# EAGLE schematic digitizer2 (EAGLE 8.0.1)

## Sheet 1 of 2
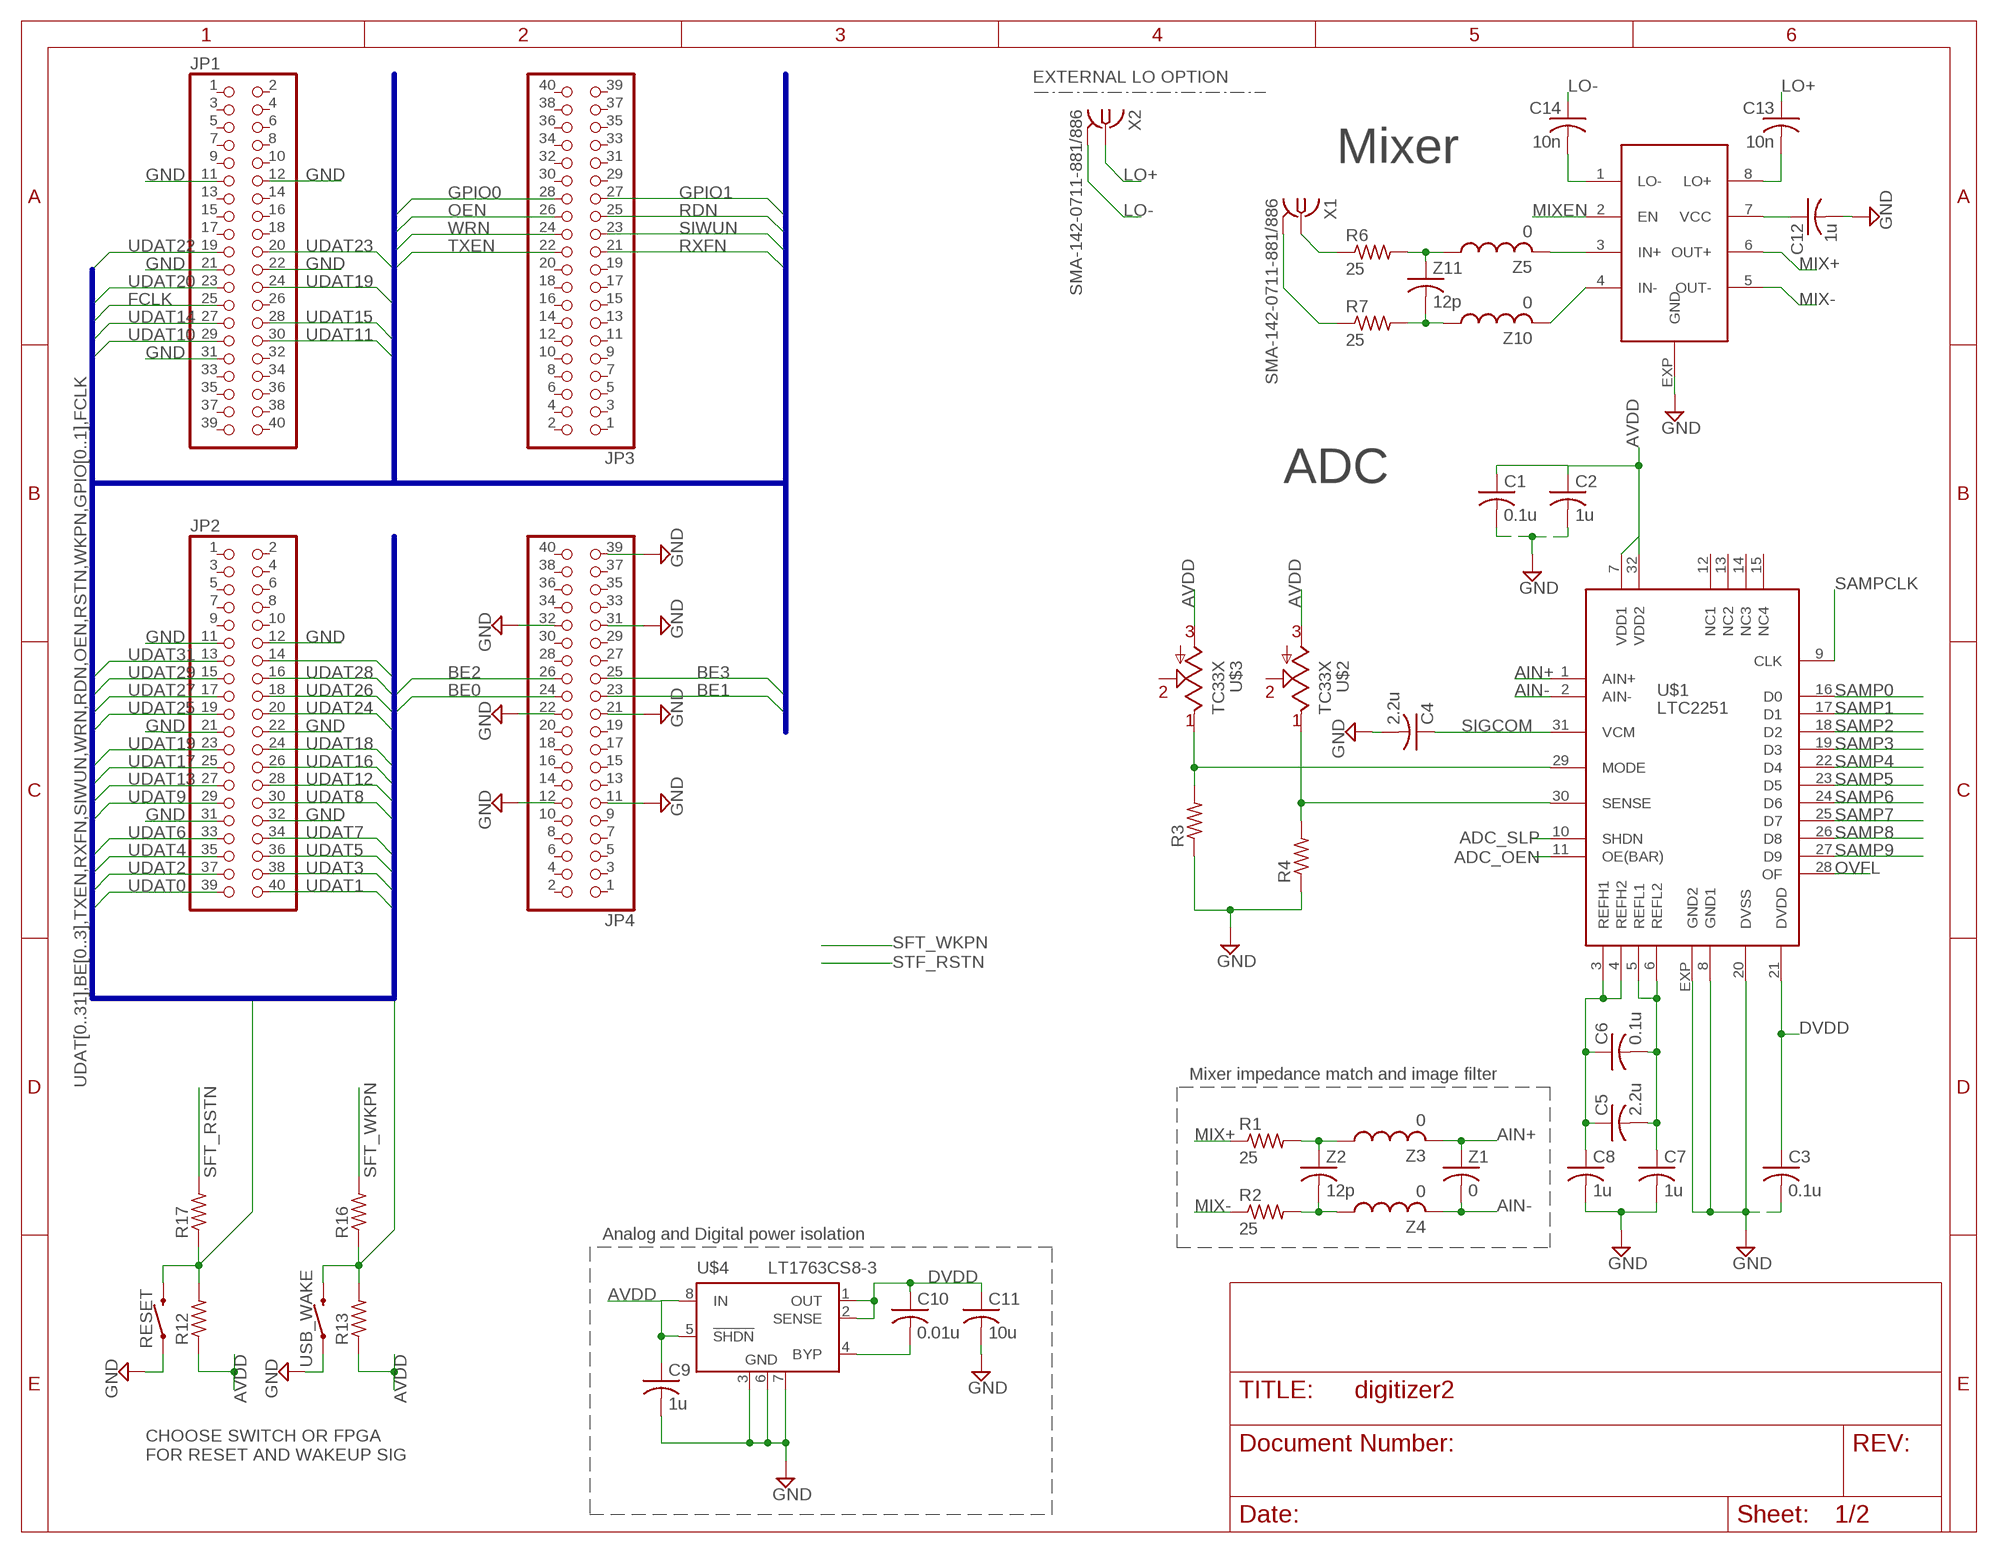
[diagram p0: schematic, sheet 1]

### Parts
C1  0.1u  C-USC0402  [C0402]
C2  1u  C-USC0402  [C0402]
C3  0.1u  C-USC0402  [C0402]
C4  2.2u  C-USC0402  [C0402]
C5  2.2u  C-USC0402  [C0402]
C6  0.1u  C-USC0402  [C0402]
C7  1u  C-USC0402  [C0402]
C8  1u  C-USC0402  [C0402]
C9  1u  C-USC0402  [C0402]
C10  0.01u  C-USC0402  [C0402]
C11  10u  C-USC0402  [C0402]
C12  1u  C-USC0402  [C0402]
C13  10n  C-USC0402  [C0402]
C14  10n  C-USC0402  [C0402]
JP1  PINHD-2X20  [2X20]
JP2  PINHD-2X20  [2X20]
JP3  PINHD-2X20  [2X20]
JP4  PINHD-2X20  [2X20]
R1  25  R-US_R0402  [R0402]
R2  25  R-US_R0402  [R0402]
R3  R-US_R0402  [R0402]
R4  R-US_R0402  [R0402]
R6  25  R-US_R0402  [R0402]
R7  25  R-US_R0402  [R0402]
R12  R-US_R0402  [R0402]
R13  R-US_R0402  [R0402]
R16  R-US_R0402  [R0402]
R17  R-US_R0402  [R0402]
RESET  MOMENTARY-SWITCH-SPST-SMD-6.0X3.5MM  [TACTILE_SWITCH_SMD_6.0X3.5MM]
U$1  LTC2251  [HVQFN32]
U$2  TC33X  [SC59-POT]
U$3  TC33X  [SC59-POT]
U$4  LT1763CS8-3  [SOIC8]
U$5  LT5560  [DFN8-3X3]
USB_WAKE  MOMENTARY-SWITCH-SPST-SMD-6.0X3.5MM  [TACTILE_SWITCH_SMD_6.0X3.5MM]
X1  SMA-142-0711-881/886  [J502-ND-142-0711-881/886]
X2  SMA-142-0711-881/886  [J502-ND-142-0711-881/886]
Z1  0  C-USC0402  [C0402]
Z2  12p  C-USC0402  [C0402]
Z3  0  L-US0402  [R0402]
Z4  0  L-US0402  [R0402]
Z5  0  L-US0402  [R0402]
Z10  0  L-US0402  [R0402]
Z11  12p  C-USC0402  [C0402]

### Nets
ADC_OEN: U$1.11(OE(BAR))
ADC_SLP: U$1.10(SHDN)
AIN+: U$1.1(AIN+) Z1.1 Z3.2
AIN-: U$1.2(AIN-) Z1.2 Z4.2
AVDD: C1.1 C2.1 C9.1 R12.1 R13.1 U$1.7(VDD1) U$1.32(VDD2) U$2.3 U$3.3 U$4.5(!SHDN) U$4.8(IN)
BE0: JP4.24 ; also sheet 2
BE1: JP4.23 ; also sheet 2
BE2: JP4.26 ; also sheet 2
BE3: JP4.25 ; also sheet 2
DVDD: C3.1 C10.1 C11.1 U$1.21(DVDD) U$4.1(OUT) U$4.2(SENSE) ; also sheet 2
FCLK: JP1.25 ; also sheet 2
GND: C1.2 C2.2 C3.2 C4.2 C7.2 C8.2 C9.2 C11.2 C12.2 JP1.11 JP1.12 JP1.21 JP1.22 JP1.31 JP2.11 JP2.12 JP2.21 JP2.22 JP2.31 JP2.32 R3.1 R4.1 RESET.1 U$1.8(GND1) U$1.20(DVSS) U$1.EXP(GND2) U$4.3(GND) U$4.6(GND) U$4.7(GND) U$5.EXP(GND) USB_WAKE.1 ; also sheet 2
GND1: JP4.32
GND2: JP4.22
GND3: JP4.12
GND4: JP4.11
GND5: JP4.21
GND6: JP4.31
GPIO0: JP3.28 ; also sheet 2
GPIO1: JP3.27 ; also sheet 2
LO+: C13.1 X2.1
LO-: C14.1 X2.G@1 X2.G@2 X2.G@3 X2.G@4
MIX+: R1.1 U$5.6(OUT+)
MIX-: R2.1 U$5.5(OUT-)
MIXEN: U$5.2(EN)
N$1: R7.1 X1.G@1 X1.G@2 X1.G@3 X1.G@4
N$2: C5.1 C6.1 C8.1 U$1.3(REFH1) U$1.4(REFH2)
N$3: C5.2 C6.2 C7.1 U$1.5(REFL1) U$1.6(REFL2)
N$4: R3.2 U$1.29(MODE) U$3.1
N$5: R4.2 U$1.30(SENSE) U$2.1
N$6: R1.2 Z2.1 Z3.1
N$7: R2.2 Z2.2 Z4.1
N$9: C10.2 U$4.4(BYP)
N$10: R6.1 X1.1
N$20: C12.1 U$5.7(VCC)
N$21: C14.2 U$5.1(LO-)
N$22: C13.2 U$5.8(LO+)
N$23: R6.2 Z5.1 Z11.1
N$24: U$5.3(IN+) Z5.2
N$25: U$5.4(IN-) Z10.2
N$26: R7.2 Z10.1 Z11.2
OEN: JP3.26 ; also sheet 2
OVFL: U$1.28(OF)
RDN: JP3.25 ; also sheet 2
RSTN: R12.2 R17.1 RESET.2 ; also sheet 2
RXFN: JP3.21 ; also sheet 2
SAMP0: U$1.16(D0)
SAMP1: U$1.17(D1)
SAMP2: U$1.18(D2)
SAMP3: U$1.19(D3)
SAMP4: U$1.22(D4)
SAMP5: U$1.23(D5)
SAMP6: U$1.24(D6)
SAMP7: U$1.25(D7)
SAMP8: U$1.26(D8)
SAMP9: U$1.27(D9)
SAMPCLK: U$1.9(CLK)
SFT_RSTN: R17.2
SFT_WKPN: R16.2
SIGCOM: C4.1 U$1.31(VCM)
SIWUN: JP3.23 ; also sheet 2
TXEN: JP3.22 ; also sheet 2
UDAT0: JP2.39 ; also sheet 2
UDAT1: JP2.40 ; also sheet 2
UDAT2: JP2.37 ; also sheet 2
UDAT3: JP2.38 ; also sheet 2
UDAT4: JP2.35 ; also sheet 2
UDAT5: JP2.36 ; also sheet 2
UDAT6: JP2.33 ; also sheet 2
UDAT7: JP2.34 ; also sheet 2
UDAT8: JP2.30 ; also sheet 2
UDAT9: JP2.29 ; also sheet 2
UDAT10: JP1.29 ; also sheet 2
UDAT11: JP1.30 ; also sheet 2
UDAT12: JP2.28 ; also sheet 2
UDAT13: JP2.27 ; also sheet 2
UDAT14: JP1.27 ; also sheet 2
UDAT15: JP1.28 ; also sheet 2
UDAT16: JP2.26 ; also sheet 2
UDAT17: JP2.25 ; also sheet 2
UDAT18: JP2.24 ; also sheet 2
UDAT19: JP1.24 JP2.23 ; also sheet 2
UDAT20: JP1.23 ; also sheet 2
UDAT22: JP1.19 ; also sheet 2
UDAT23: JP1.20 ; also sheet 2
UDAT24: JP2.20 ; also sheet 2
UDAT25: JP2.19 ; also sheet 2
UDAT26: JP2.18 ; also sheet 2
UDAT27: JP2.17 ; also sheet 2
UDAT28: JP2.16 ; also sheet 2
UDAT29: JP2.15 ; also sheet 2
UDAT30: JP2.14 ; also sheet 2
UDAT31: JP2.13 ; also sheet 2
WKPN: R13.2 R16.1 USB_WAKE.2 ; also sheet 2
WRN: JP3.24 ; also sheet 2
Unconnected: JP1.1 JP1.2 JP1.3 JP1.4 JP1.5 JP1.6 JP1.7 JP1.8 JP1.9 JP1.10 JP1.13 JP1.14 JP1.15 JP1.16 JP1.17 JP1.18 JP1.26 JP1.32 JP1.33 JP1.34 JP1.35 JP1.36 JP1.37 JP1.38 JP1.39 JP1.40 JP2.1 JP2.2 JP2.3 JP2.4 JP2.5 JP2.6 JP2.7 JP2.8 JP2.9 JP2.10 JP3.1 JP3.2 JP3.3 JP3.4 JP3.5 JP3.6 JP3.7 JP3.8 JP3.9 JP3.10 JP3.11 JP3.12 JP3.13 JP3.14 JP3.15 JP3.16 JP3.17 JP3.18 JP3.19 JP3.20 JP3.29 JP3.30 JP3.31 JP3.32 JP3.33 JP3.34 JP3.35 JP3.36 JP3.37 JP3.38 JP3.39 JP3.40 JP4.1 JP4.2 JP4.3 JP4.4 JP4.5 JP4.6 JP4.7 JP4.8 JP4.9 JP4.10 JP4.13 JP4.14 JP4.15 JP4.16 JP4.17 JP4.18 JP4.19 JP4.20 JP4.27 JP4.28 JP4.29 JP4.30 JP4.33 JP4.34 JP4.35 JP4.36 JP4.37 JP4.38 JP4.39 JP4.40 U$1.12(NC1) U$1.13(NC2) U$1.14(NC3) U$1.15(NC4) U$2.2 U$3.2

### Buses
UDAT[0..31],BE[0..3],TXEN,RXFN,SIWUN,WRN,RDN,OEN,RSTN,WKPN,GPIO[0..1],FCLK

### Notes on the sheet
- EXTERNAL LO OPTION
- Mixer
- ADC
- Mixer impedance match and image filter
- Analog and Digital power isolation
- CHOOSE SWITCH OR FPGA
  FOR RESET AND WAKEUP SIG

## Sheet 2 of 2
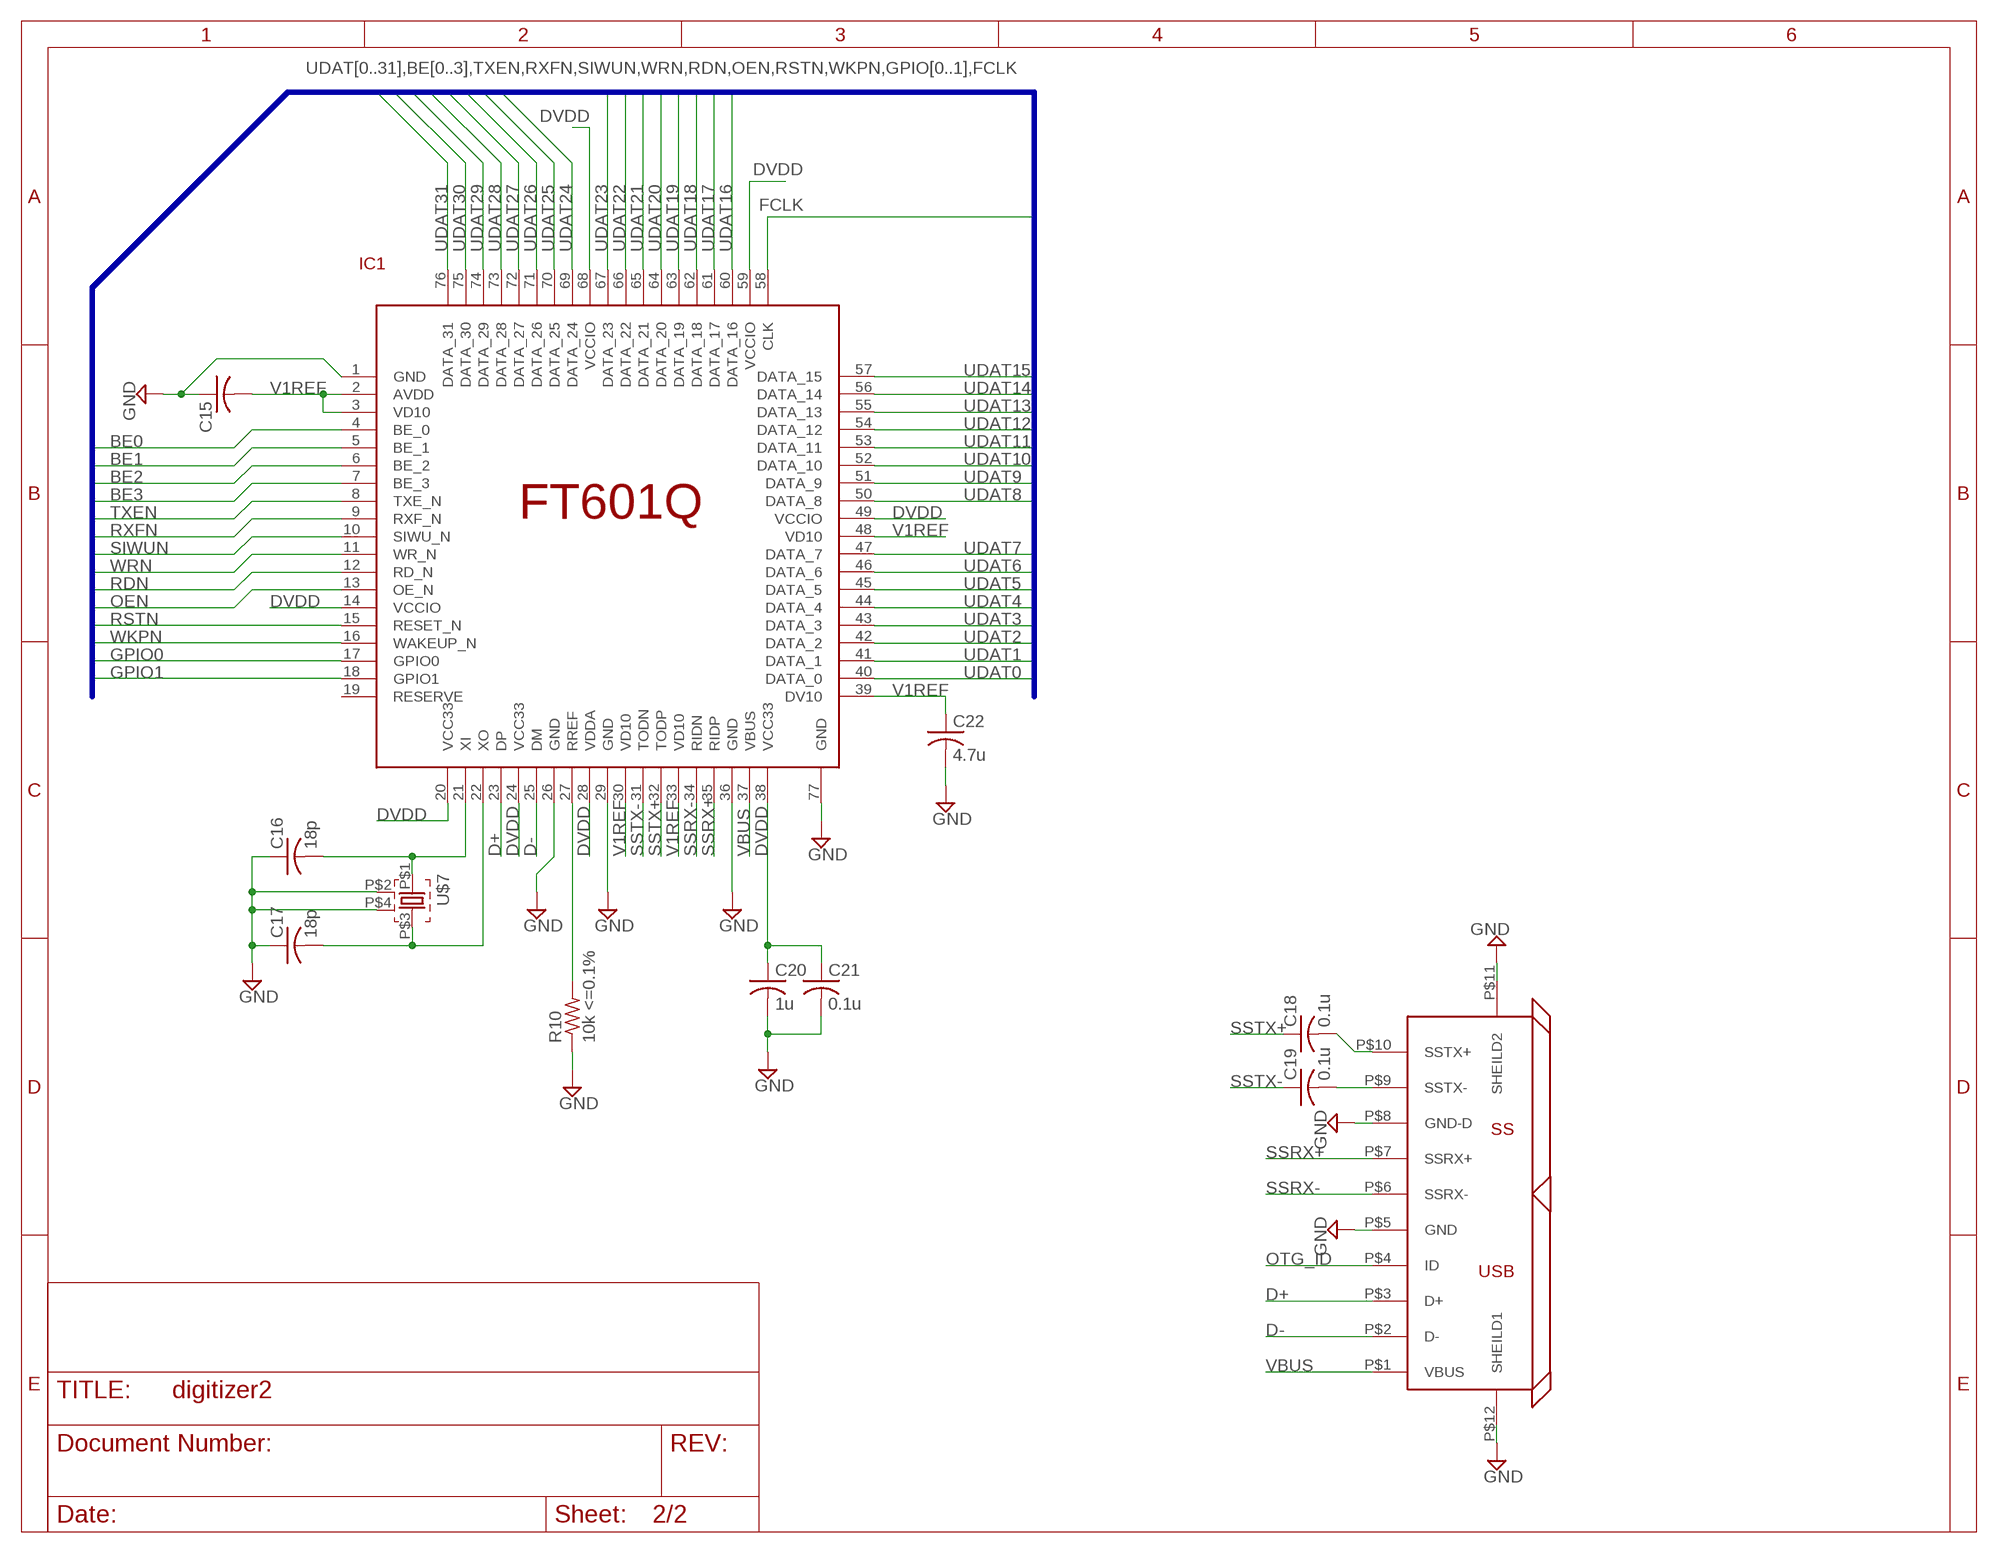
[diagram p1: schematic, sheet 2]

### Parts
C15  C-USC0402  [C0402]
C16  18p  C-USC0402  [C0402]
C17  18p  C-USC0402  [C0402]
C18  0.1u  C-USC0402  [C0402]
C19  0.1u  C-USC0402  [C0402]
C20  1u  C-USC0402  [C0402]
C21  0.1u  C-USC0402  [C0402]
C22  4.7u  C-USC0402  [C0402]
IC1  FT601QQFN76  [QFN76]
R10  10k <=0.1%  R-US_R0402  [R0402]
U$6  USB3.0  [USB-MICROB-3.0]
U$7  CX3225SB_UKY1C-H1-16357-0045  [UKY1C-H1-16357-0045]

### Nets
BE0: IC1.4(BE_0) ; also sheet 1
BE1: IC1.5(BE_1) ; also sheet 1
BE2: IC1.6(BE_2) ; also sheet 1
BE3: IC1.7(BE_3) ; also sheet 1
D+: IC1.23(DP) U$6.P$3(D+)
D-: IC1.25(DM) U$6.P$2(D-)
DVDD: C20.1 C21.1 IC1.14(VCCIO) IC1.20(VCC33) IC1.24(VCC33) IC1.28(VDDA) IC1.38(VCC33) IC1.49(VCCIO) IC1.59(VCCIO) IC1.68(VCCIO) ; also sheet 1
FCLK: IC1.58(CLK) ; also sheet 1
GND: C15.1 C16.1 C17.1 C20.2 C21.2 C22.2 IC1.1(GND) IC1.26(GND) IC1.29(GND) IC1.36(GND) IC1.77(GND) R10.1 U$6.P$5(GND) U$6.P$8(GND-D) U$6.P$11(SHEILD2) U$6.P$12(SHEILD1) U$7.P$2 U$7.P$4 ; also sheet 1
GPIO0: IC1.17(GPIO0) ; also sheet 1
GPIO1: IC1.18(GPIO1) ; also sheet 1
N$11: C16.2 IC1.21(XI) U$7.P$1
N$12: C17.2 IC1.22(XO) U$7.P$3
N$13: IC1.27(RREF) R10.2
N$14: C18.2 U$6.P$10(SSTX+)
N$15: C19.2 U$6.P$9(SSTX-)
OEN: IC1.13(OE_N) ; also sheet 1
OTG_ID: U$6.P$4(ID)
RDN: IC1.12(RD_N) ; also sheet 1
RSTN: IC1.15(RESET_N) ; also sheet 1
RXFN: IC1.9(RXF_N) ; also sheet 1
SIWUN: IC1.10(SIWU_N) ; also sheet 1
SSRX+: IC1.35(RIDP) U$6.P$7(SSRX+)
SSRX-: IC1.34(RIDN) U$6.P$6(SSRX-)
SSTX+: C18.1 IC1.32(TODP)
SSTX-: C19.1 IC1.31(TODN)
TXEN: IC1.8(TXE_N) ; also sheet 1
UDAT0: IC1.40(DATA_0) ; also sheet 1
UDAT1: IC1.41(DATA_1) ; also sheet 1
UDAT2: IC1.42(DATA_2) ; also sheet 1
UDAT3: IC1.43(DATA_3) ; also sheet 1
UDAT4: IC1.44(DATA_4) ; also sheet 1
UDAT5: IC1.45(DATA_5) ; also sheet 1
UDAT6: IC1.46(DATA_6) ; also sheet 1
UDAT7: IC1.47(DATA_7) ; also sheet 1
UDAT8: IC1.50(DATA_8) ; also sheet 1
UDAT9: IC1.51(DATA_9) ; also sheet 1
UDAT10: IC1.52(DATA_10) ; also sheet 1
UDAT11: IC1.53(DATA_11) ; also sheet 1
UDAT12: IC1.54(DATA_12) ; also sheet 1
UDAT13: IC1.55(DATA_13) ; also sheet 1
UDAT14: IC1.56(DATA_14) ; also sheet 1
UDAT15: IC1.57(DATA_15) ; also sheet 1
UDAT16: IC1.60(DATA_16) ; also sheet 1
UDAT17: IC1.61(DATA_17) ; also sheet 1
UDAT18: IC1.62(DATA_18) ; also sheet 1
UDAT19: IC1.63(DATA_19) ; also sheet 1
UDAT20: IC1.64(DATA_20) ; also sheet 1
UDAT21: IC1.65(DATA_21)
UDAT22: IC1.66(DATA_22) ; also sheet 1
UDAT23: IC1.67(DATA_23) ; also sheet 1
UDAT24: IC1.69(DATA_24) ; also sheet 1
UDAT25: IC1.70(DATA_25) ; also sheet 1
UDAT26: IC1.71(DATA_26) ; also sheet 1
UDAT27: IC1.72(DATA_27) ; also sheet 1
UDAT28: IC1.73(DATA_28) ; also sheet 1
UDAT29: IC1.74(DATA_29) ; also sheet 1
UDAT30: IC1.75(DATA_30) ; also sheet 1
UDAT31: IC1.76(DATA_31) ; also sheet 1
V1REF: C15.2 C22.1 IC1.2(AVDD) IC1.3(VD10) IC1.30(VD10) IC1.33(VD10) IC1.39(DV10) IC1.48(VD10)
VBUS: IC1.37(VBUS) U$6.P$1(VBUS)
WKPN: IC1.16(WAKEUP_N) ; also sheet 1
WRN: IC1.11(WR_N) ; also sheet 1
Unconnected: IC1.19(RESERVE)

### Buses
UDAT[0..31],BE[0..3],TXEN,RXFN,SIWUN,WRN,RDN,OEN,RSTN,WKPN,GPIO[0..1],FCLK

## Library data of the parts
C1-C14 C16-C22 Z1 Z2 Z11 = resistor:C-US: CAPACITOR, American symbol
C15 = rcl:C-US: CAPACITOR, American symbol
IC1 = lt_ftdi_and_more:FT601Q
JP1-JP4 = pinhead:PINHD-2X20: PIN HEADER
R1-R4 R6 R7 R10 R12 R13 R16 R17 = resistor:R-US_: RESISTOR, American symbol
RESET USB_WAKE = SparkFun-Switches:MOMENTARY-SWITCH-SPST: Momentary Switch (Pushbutton) - SPST Normally-open (NO) SPST momentary switches (buttons, pushbuttons). Variants PTH-12MM - 12mm square, through-hole Momentary Pushbutton Switch - 12mm Square <https://www.sparkfun.com/products/9190> (COM-09190) PTH-6.0MM, PTH-6.0MM-KIT - 6.0mm square, through-hole Mini Pushbutton Switch <https://www.sparkfun.com/products/97> (COM-00097) KIT package intended for soldering kit's - only one side of pads' copper is exposed. PTH-RIGHT-ANGLE-KIT - Right-angle, through-hole Right Angle Tactile Button <https://www.sparkfun.com/products/10791> - Used on SparkFun BigTime Watch Kit <https://www.sparkfun.com/products/11734> SMD-12MM - 12mm square, surface-mount Tactile Button - SMD (12mm) <https://www.sparkfun.com/products/12993> (COM-12993) Used on SparkFun PicoBoard <https://www.sparkfun.com/products/11888> SMD-4.5MM - 4.5mm Square Trackball Switch Used on SparkFun Blackberry Trackballer Breakout <https://www.sparkfun.com/products/13169> SMD-4.6MMX2.8MM - 4.60mm x 2.80mm, surface mount Used on SparkFun SAMD21 Mini Breakout <https://www.sparkfun.com/products/13664> SMD-5.2MM, SMD-5.2-REDUNDANT - 5.2mm square, surface-mount Mini Pushbutton Switch - SMD <https://www.sparkfun.com/products/8720> (COM-08720) Used on Arduino Pro Mini <https://www.sparkfun.com/products/11114> REDUNDANT package connects both switch circuits together SMD-6.0X3.5MM - 6.0 x 3.5mm, surface mount Momentary Reset Switch SMD <https://www.sparkfun.com/products/8229> (COM-08229) SMD-6.2MM-TALL - 6.2mm square, surface mount Tactile Button - SMD (6mm) <https://www.sparkfun.com/products/12992> Used on SparkFun Digital Sandbox <https://www.sparkfun.com/products/12651> SMD-RIGHT-ANGLE - Right-angle, surface mount Used on SparkFun Block for Intel® Edison - Arduino <https://www.sparkfun.com/products/13036>; PROD_ID: SWCH-00815; SF_SKU: COM-08229
U$1 = components:LTC2251: LTC2251 125MSPS Pipelined ADC
U$2 U$3 = components:TC33X: Wiper pots
U$4 = linear-technology:LT1763CS8: 500mA, Low Noise, LDO Micropower Regulators Source: http://cds.linear.com/docs/Datasheet/1763ff.pdf; MPN: LT1763CS8-3; OC_FARNELL: unknown; OC_NEWARK: 02E0014
U$5 = components:LT5560
U$6 = components:USB3.0
U$7 = components:CX3225SB_UKY1C-H1-16357-0045
X1 X2 = con-coax:SMA-: SMA 50 Ohm End Launch Jack Receptacle - Round Contact Johnson Components Source: www.johnsoncomponents.com .. J502-ND.pdf; MF: JOHNSON COMPONENTS; MPN: 142-0711-881; OC_FARNELL: unknown; OC_NEWARK: 50B4464
Z3-Z5 Z10 = components:L-US